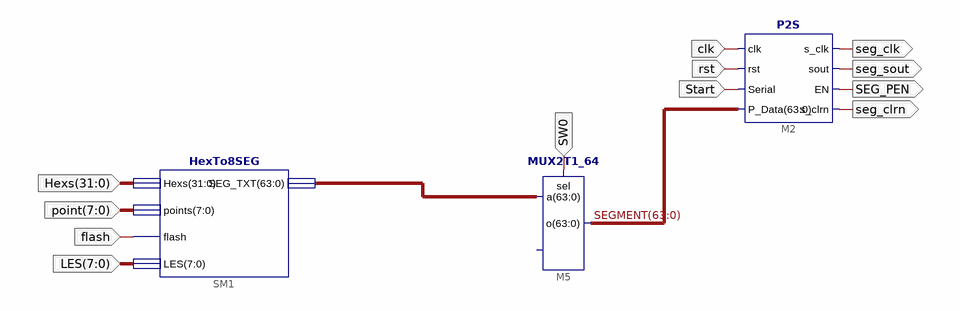
[diagram p0: schematic sheet 1]
// Xilinx ISE schematic Display.sch (kintex7) as structural Verilog: 3 symbols, 12 ports
module Display (
  input  clk,
  input  rst,
  input  Start,
  input  SW0,
  input  [31:0] Hexs,
  input  [7:0] point,
  input  [7:0] LES,
  input  flash,
  output seg_clk,
  output seg_sout,
  output SEG_PEN,
  output seg_clrn
);

  wire [63:0] SEGMENT, XLXN_1;

  P2S M2 (
    .s_clrn(seg_clrn), .sout(seg_sout), .rst(rst), .EN(SEG_PEN), .Serial(Start), .clk(clk), .s_clk(seg_clk),
    .P_Data(SEGMENT));
  MUX2T1_64 M5 (.sel(SW0), .a(XLXN_1), .o(SEGMENT));  // open: b
  HexTo8SEG SM1 (.Hexs(Hexs), .points(point), .flash(flash), .LES(LES), .SEG_TXT(XLXN_1));
endmodule
